# Altium schematic sheet 40_Temp.SchDoc
size A3; SheetNumber: 5; SheetTotal: 12
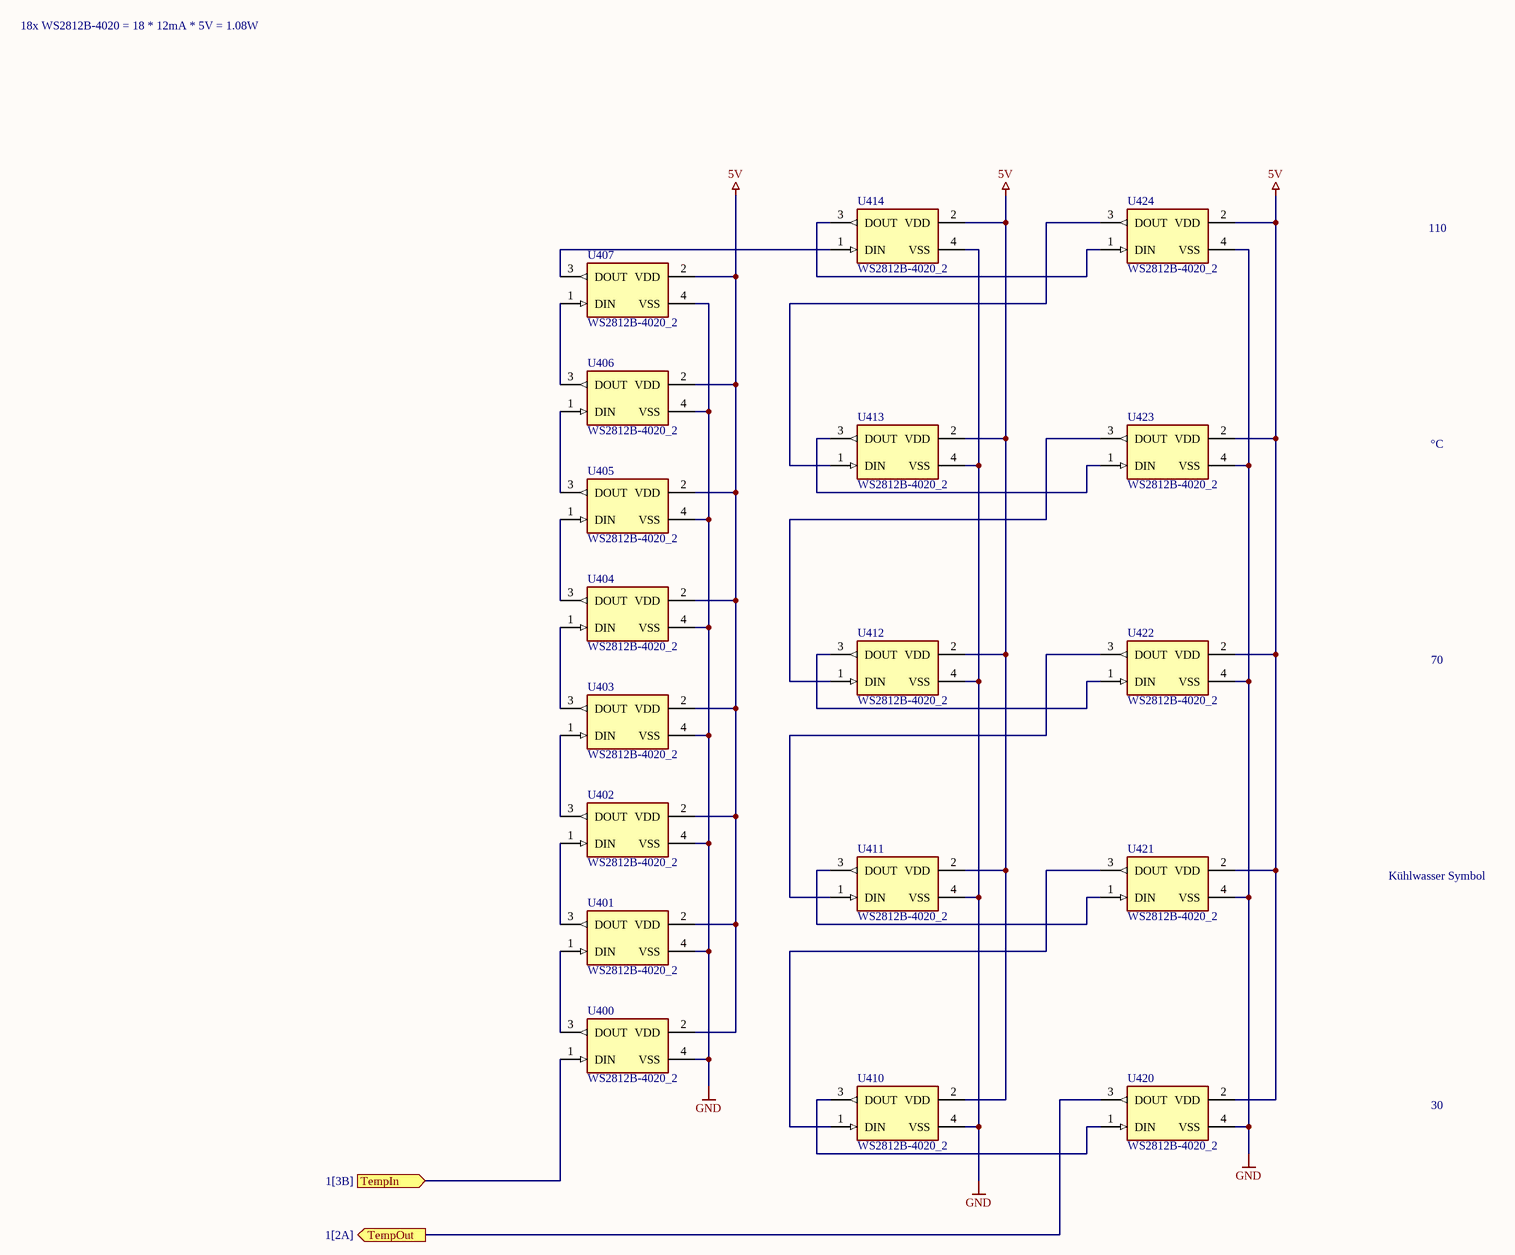
[diagram p0: 40_Temp.SchDoc]

## Parts
U400  WS2812B-4020_2  [LED_WS2812B-4020]
U401  WS2812B-4020_2  [LED_WS2812B-4020]
U402  WS2812B-4020_2  [LED_WS2812B-4020]
U403  WS2812B-4020_2  [LED_WS2812B-4020]
U404  WS2812B-4020_2  [LED_WS2812B-4020]
U405  WS2812B-4020_2  [LED_WS2812B-4020]
U406  WS2812B-4020_2  [LED_WS2812B-4020]
U407  WS2812B-4020_2  [LED_WS2812B-4020]
U410  WS2812B-4020_2  [LED_WS2812B-4020]
U411  WS2812B-4020_2  [LED_WS2812B-4020]
U412  WS2812B-4020_2  [LED_WS2812B-4020]
U413  WS2812B-4020_2  [LED_WS2812B-4020]
U414  WS2812B-4020_2  [LED_WS2812B-4020]
U420  WS2812B-4020_2  [LED_WS2812B-4020]
U421  WS2812B-4020_2  [LED_WS2812B-4020]
U422  WS2812B-4020_2  [LED_WS2812B-4020]
U423  WS2812B-4020_2  [LED_WS2812B-4020]
U424  WS2812B-4020_2  [LED_WS2812B-4020]

## Ports
TempIn (in, see 1[3B]), TempOut (out, see 1[2A])

## Nets
5V: U400.2(VDD) U401.2(VDD) U402.2(VDD) U403.2(VDD) U404.2(VDD) U405.2(VDD) U406.2(VDD) U407.2(VDD) U410.2(VDD) U411.2(VDD) U412.2(VDD) U413.2(VDD) U414.2(VDD) U420.2(VDD) U421.2(VDD) U422.2(VDD) U423.2(VDD) U424.2(VDD)
GND: U400.4(VSS) U401.4(VSS) U402.4(VSS) U403.4(VSS) U404.4(VSS) U405.4(VSS) U406.4(VSS) U407.4(VSS) U410.4(VSS) U411.4(VSS) U412.4(VSS) U413.4(VSS) U414.4(VSS) U420.4(VSS) U421.4(VSS) U422.4(VSS) U423.4(VSS) U424.4(VSS)
TempIn: U400.1(DIN) ; port TempIn
TempOut: U420.3(DOUT) ; port TempOut
NetU400_3: U400.3(DOUT) U401.1(DIN)
NetU401_3: U401.3(DOUT) U402.1(DIN)
NetU402_3: U402.3(DOUT) U403.1(DIN)
NetU403_3: U403.3(DOUT) U404.1(DIN)
NetU404_3: U404.3(DOUT) U405.1(DIN)
NetU405_3: U405.3(DOUT) U406.1(DIN)
NetU406_3: U406.3(DOUT) U407.1(DIN)
NetU407_3: U407.3(DOUT) U414.1(DIN)
NetU410_1: U410.1(DIN) U421.3(DOUT)
NetU410_3: U410.3(DOUT) U420.1(DIN)
NetU411_1: U411.1(DIN) U422.3(DOUT)
NetU411_3: U411.3(DOUT) U421.1(DIN)
NetU412_1: U412.1(DIN) U423.3(DOUT)
NetU412_3: U412.3(DOUT) U422.1(DIN)
NetU413_1: U413.1(DIN) U424.3(DOUT)
NetU413_3: U413.3(DOUT) U423.1(DIN)
NetU414_3: U414.3(DOUT) U424.1(DIN)

## Notes on the sheet
- 18x WS2812B-4020 = 18 * 12mA * 5V = 1.08W
- 110
- °C
- 70
- Kühlwasser Symbol
- 30

## Library data of the parts
U400-U407 U410-U414 U420-U424 = WS2812B-4020_2: 12mA RGB SMD,2x4mm Light Emitting Diodes; MF: Worldsemi; Price: None; MP: WS2812B-4020; Availability: Not in stock; SnapEDA_Link: https://www.snapeda.com/parts/WS2812B-4020/Worldsemi/view-part/?ref=snap; Check_prices: https://www.snapeda.com/parts/WS2812B-4020/Worldsemi/view-part/?ref=eda; Value: *; Package: Package